# EAGLE design Breakout_v2 (EAGLE 7.5.0)
CNAME: EARS PocketQube Breakout Board; CREVISION: 2.0; DESIGNER: L. Stant
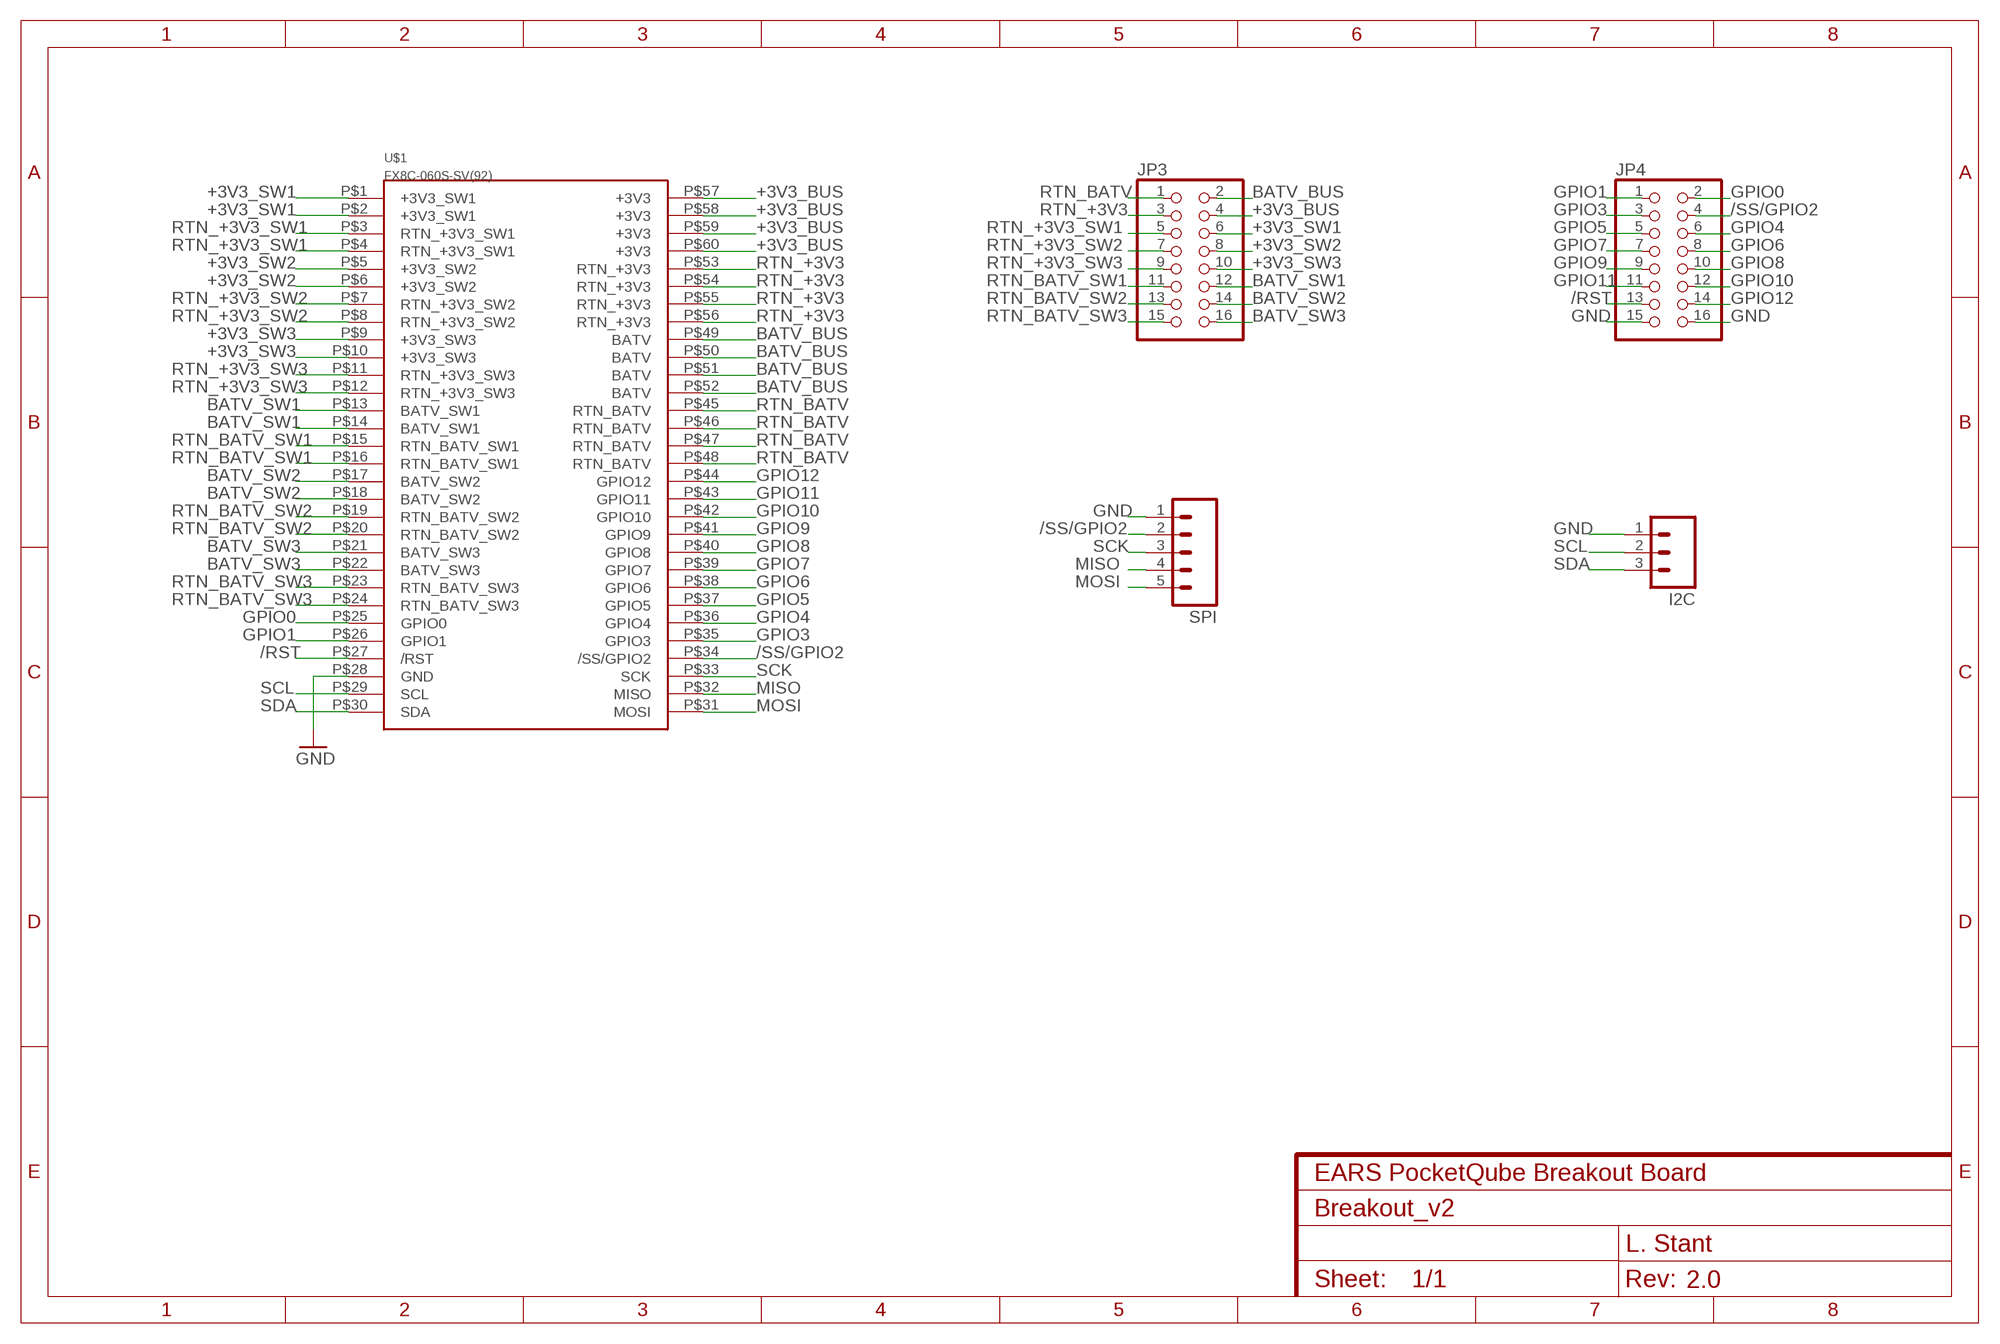
[diagram p0: schematic, sheet 1]

## Parts
I2C  M03PTH  [1X03]
JP3  PINHD-2X8  [2X08]
JP4  PINHD-2X8  [2X08]
SPI  M05PTH  [1X05]
U$1  FX8C-060S-SV(92)  [FX8C-060S-SV(92)]

## Nets
+3V3_BUS: JP3.4 U$1.P$57(+3V3) U$1.P$58(+3V3) U$1.P$59(+3V3) U$1.P$60(+3V3)
+3V3_SW1: JP3.6 U$1.P$1(+3V3_SW1) U$1.P$2(+3V3_SW1)
+3V3_SW2: JP3.8 U$1.P$5(+3V3_SW2) U$1.P$6(+3V3_SW2)
+3V3_SW3: JP3.10 U$1.P$9(+3V3_SW3) U$1.P$10(+3V3_SW3)
/RST: JP4.13 U$1.P$27(/RST)
/SS/GPIO2: JP4.4 SPI.2 U$1.P$34(/SS/GPIO2)
BATV_BUS: JP3.2 U$1.P$49(BATV) U$1.P$50(BATV) U$1.P$51(BATV) U$1.P$52(BATV)
BATV_SW1: JP3.12 U$1.P$13(BATV_SW1) U$1.P$14(BATV_SW1)
BATV_SW2: JP3.14 U$1.P$17(BATV_SW2) U$1.P$18(BATV_SW2)
BATV_SW3: JP3.16 U$1.P$21(BATV_SW3) U$1.P$22(BATV_SW3)
GND: I2C.1 JP4.15 JP4.16 SPI.1 U$1.P$28(GND)
GPIO0: JP4.2 U$1.P$25(GPIO0)
GPIO1: JP4.1 U$1.P$26(GPIO1)
GPIO3: JP4.3 U$1.P$35(GPIO3)
GPIO4: JP4.6 U$1.P$36(GPIO4)
GPIO5: JP4.5 U$1.P$37(GPIO5)
GPIO6: JP4.8 U$1.P$38(GPIO6)
GPIO7: JP4.7 U$1.P$39(GPIO7)
GPIO8: JP4.10 U$1.P$40(GPIO8)
GPIO9: JP4.9 U$1.P$41(GPIO9)
GPIO10: JP4.12 U$1.P$42(GPIO10)
GPIO11: JP4.11 U$1.P$43(GPIO11)
GPIO12: JP4.14 U$1.P$44(GPIO12)
MISO: SPI.4 U$1.P$32(MISO)
MOSI: SPI.5 U$1.P$31(MOSI)
RTN_+3V3: JP3.3 U$1.P$53(RTN_+3V3) U$1.P$54(RTN_+3V3) U$1.P$55(RTN_+3V3) U$1.P$56(RTN_+3V3)
RTN_+3V3_SW1: JP3.5 U$1.P$3(RTN_+3V3_SW1) U$1.P$4(RTN_+3V3_SW1)
RTN_+3V3_SW2: JP3.7 U$1.P$7(RTN_+3V3_SW2) U$1.P$8(RTN_+3V3_SW2)
RTN_+3V3_SW3: JP3.9 U$1.P$11(RTN_+3V3_SW3) U$1.P$12(RTN_+3V3_SW3)
RTN_BATV: JP3.1 U$1.P$45(RTN_BATV) U$1.P$46(RTN_BATV) U$1.P$47(RTN_BATV) U$1.P$48(RTN_BATV)
RTN_BATV_SW1: JP3.11 U$1.P$15(RTN_BATV_SW1) U$1.P$16(RTN_BATV_SW1)
RTN_BATV_SW2: JP3.13 U$1.P$19(RTN_BATV_SW2) U$1.P$20(RTN_BATV_SW2)
RTN_BATV_SW3: JP3.15 U$1.P$23(RTN_BATV_SW3) U$1.P$24(RTN_BATV_SW3)
SCK: SPI.3 U$1.P$33(SCK)
SCL: I2C.2 U$1.P$29(SCL)
SDA: I2C.3 U$1.P$30(SDA)

## Library data of the parts
I2C = SparkFun-Connectors:M03: Header 3 Standard 3-pin 0.1" header. Use with straight break away headers (SKU : PRT-00116), right angle break away headers (PRT-00553), swiss pins (PRT-00743), machine pins (PRT-00117), and female headers (PRT-00115). Molex polarized connector foot print use with SKU : PRT-08232 with associated crimp pins and housings.
JP3 JP4 = pinhead:PINHD-2X8: PIN HEADER
SPI = SparkFun-Connectors:M05: Header 5 Standard 5-pin 0.1" header. Use with straight break away headers (SKU : PRT-00116), right angle break away headers (PRT-00553), swiss pins (PRT-00743), machine pins (PRT-00117), and female headers (PRT-00115). Molex polarized connector foot print use with SKU : PRT-08230 with associated crimp pins and housings.
U$1 = Template:FX8C-060S-SV(92)

## Board
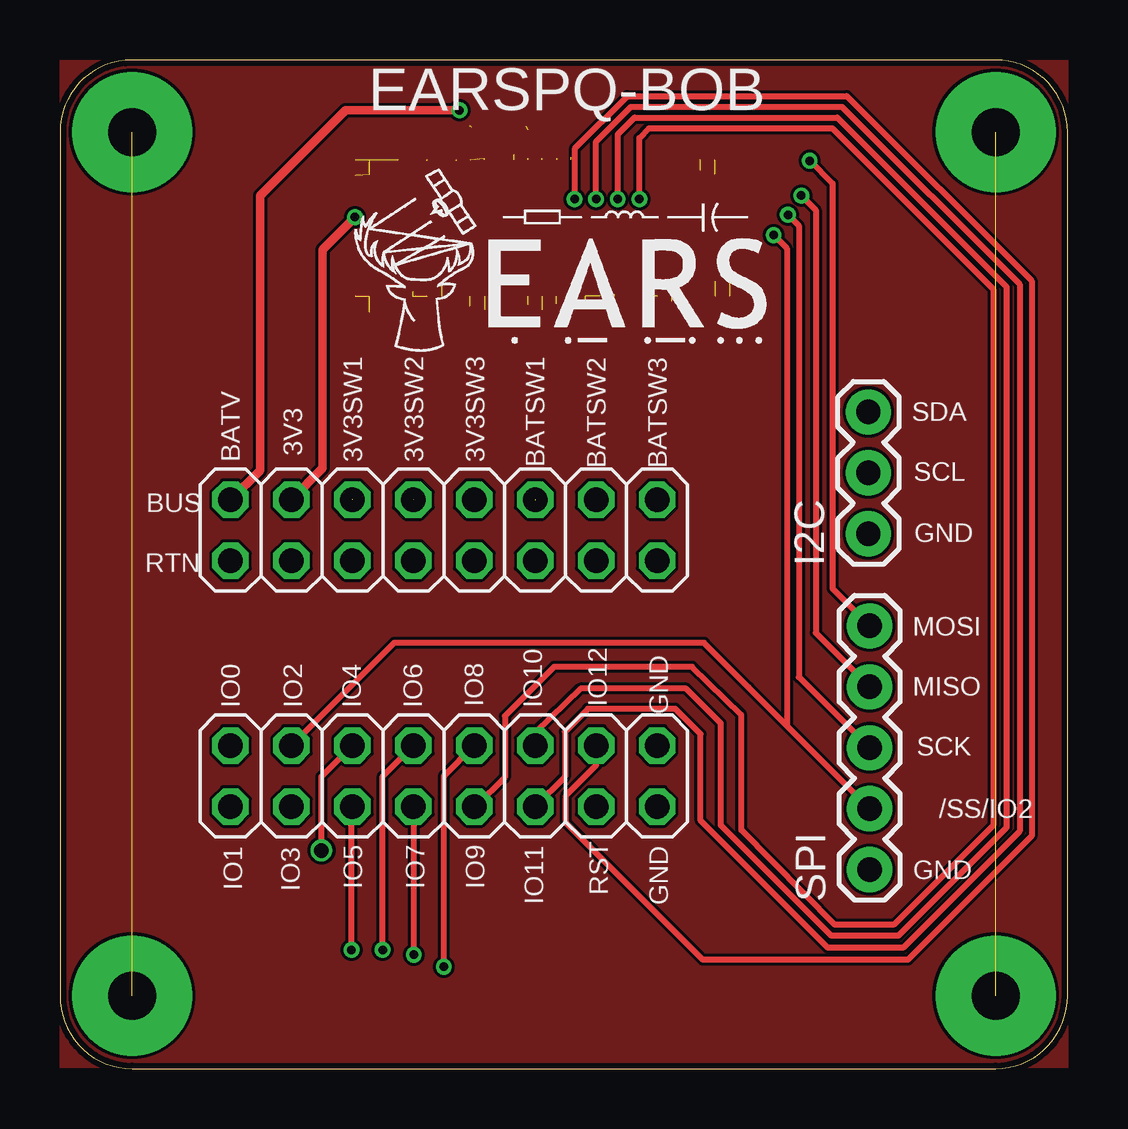
[diagram p1: board, top side]
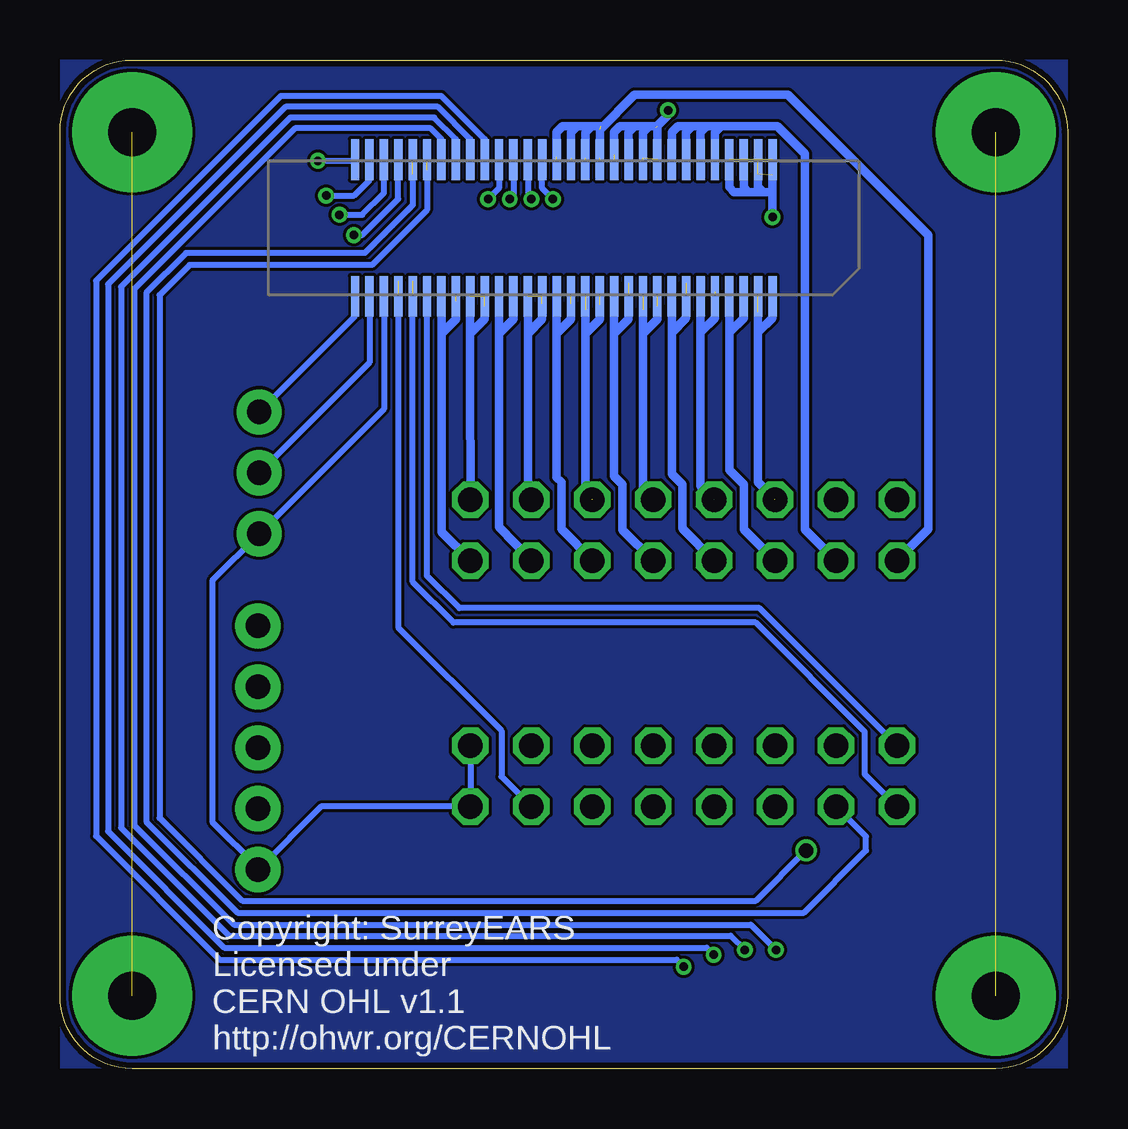
[diagram p2: board, bottom side, seen from below]

Size 42 x 42.05 mm. Coordinates in mm from the lower left corner, seen from the top.
Outline: 3,0 39,0 arc90 42,3.05 42,39.05 arc90 39,42.05 3,42.05 arc90 0,39.05 0,3.05 arc90 3,0
Copper layers (1*16): Top 0.035mm / dielectric 1.5mm / Bottom 0.035mm
Design rules "dirt_cheap_dirty_boards.v1": minimum track width 5mil, minimum drill 12mil, track to track 5mil, track to pad 5mil, pad to pad 5mil, via to via 5mil, smd to smd 0mil, copper to edge 10mil, drill to drill 10mil, minimum pad ring 10mil, minimum via ring 6mil, stop-mask expansion 2mil, vias tented up to drill 25mil, thermal gap 10mil

### Footprints (pad centres in the part's own frame; a part is rotated, then mirrored left to right if it is on the bottom)
1X03 = drill 1.016 pad 1.88: 1 0,0; 2 2.54,0; 3 5.08,0
2X08 = drill 1.016 octagon: 1 -8.89,-1.27; 2 -8.89,1.27; 3 -6.35,-1.27; 4 -6.35,1.27; 5 -3.81,-1.27; 6 -3.81,1.27; 7 -1.27,-1.27; 8 -1.27,1.27; 9 1.27,-1.27; 10 1.27,1.27; 11 3.81,-1.27; 12 3.81,1.27; 13 6.35,-1.27; 14 6.35,1.27; 15 8.89,-1.27; 16 8.89,1.27
1X05 = drill 1.016 pad 1.88: 1 0,0; 2 2.54,0; 3 5.08,0; 4 7.62,0; 5 10.16,0
FX8C-060S-SV(92) = smd 0.35 x 1.7: P$1 -8.7,2.85; P$2 -8.1,2.85; P$3 -7.5,2.85; P$4 -6.9,2.85; P$5 -6.3,2.85; P$6 -5.7,2.85; P$7 -5.1,2.85; P$8 -4.5,2.85; P$9 -3.9,2.85; P$10 -3.3,2.85; P$11 -2.7,2.85; P$12 -2.1,2.85; P$13 -1.5,2.85; P$14 -0.9,2.85; P$15 -0.3,2.85; P$16 0.3,2.85; P$17 0.9,2.85; P$18 1.5,2.85; P$19 2.1,2.85; P$20 2.7,2.85; P$21 3.3,2.85; P$22 3.9,2.85; P$23 4.5,2.85; P$24 5.1,2.85; P$25 5.7,2.85; P$26 6.3,2.85; P$27 6.9,2.85; P$28 7.5,2.85; P$29 8.1,2.85; P$30 8.7,2.85; P$31 8.7,-2.85; P$32 8.1,-2.85; P$33 7.5,-2.85; P$34 6.9,-2.85; P$35 6.3,-2.85; P$36 5.7,-2.85; P$37 5.1,-2.85; P$38 4.5,-2.85; P$39 3.9,-2.85; P$40 3.3,-2.85; P$41 2.7,-2.85; P$42 2.1,-2.85; P$43 1.5,-2.85; P$44 0.9,-2.85; P$45 0.3,-2.85; P$46 -0.3,-2.85; P$47 -0.9,-2.85; P$48 -1.5,-2.85; P$49 -2.1,-2.85; P$50 -2.7,-2.85; P$51 -3.3,-2.85; P$52 -3.9,-2.85; P$53 -4.5,-2.85; P$54 -5.1,-2.85; P$55 -5.7,-2.85; P$56 -6.3,-2.85; P$57 -6.9,-2.85; P$58 -7.5,-2.85; P$59 -8.1,-2.85; P$60 -8.7,-2.85

### Placement (x,y rotation side)
I2C  33.7,22.3 90 top
JP3  16,22.45 0 top
JP4  16,12.2 0 top
SPI  33.75,8.3 90 top
U$1  21,35.05 180 bottom
U$2  [EARSLOGOFULL]  21.7,32.75 0 top

### Tracks (layer width: path | path; a pad name or v marks a point on that pad's centre or on a via)
+3V3_BUS  (via drill 0.36)  (5 unrouted)
  Top 0.36: JP3.4 10.95,25.05 10.95,34.15 v12.3,35.5
  Bottom 0.36: 12.3,37.25 v12.3,35.5 | 14.1,37.15 14.1,36.75 13.9,36.55 13.3,36.55 | 13.3,36.55 12.7,36.55 | 12.7,36.55 12.3,36.55 | 13.5,37.25 13.5,36.75 13.3,36.55 | 12.9,37.3 12.9,36.75 12.7,36.55
+3V3_SW1  (3 unrouted)
  Bottom 0.36: 12.19,23.74 12.9,24.45 12.9,30.7 | 12.3,31.3 12.9,30.7 | 12.9,31.55 12.9,30.7
+3V3_SW2  (3 unrouted)
  Bottom 0.36: JP3.8 15.3,24.3 15.3,30.7 | 14.7,32.4 14.7,31.3 15.3,30.7 | 15.3,31.55 15.3,30.7
+3V3_SW3  (2 unrouted)
  Bottom 0.36: JP3.10 17.7,24.15 17.7,30.4 17.7,30.65 | 17.1,31.8 17.1,31.25 17.7,30.65 | 17.7,31.65 17.7,30.65
/RST  (1 unrouted)
  Bottom 0.254: 27.9,32.82 27.9,18.4 23.6,14.1 23.6,12.18 JP4.13
/SS/GPIO2  (via drill 0.36)
  Top 0.254: 30.3,14.29 30.3,34.2 v29.75,34.75 | 30.3,14.29 SPI.2 | 30.3,14.29 28.7,15.89 28.7,15.9 26.85,17.75 13.93,17.75 JP4.4
  Bottom 0.254: v29.75,34.75 29.4,34.75 27.9,36.25 U$1.P$34
BATV_BUS  (via drill 0.36)  (4 unrouted)
  Top 0.36: JP3.2 8.35,24.93 8.35,36.4 11.9,39.95 v16.65,39.95
  Bottom 0.36: v16.65,39.95 16.65,39.75 17.15,39.25 | 17.45,39.3 17.1,39.3 17.1,38.6 | 17.45,39.3 17.7,39.05 17.7,37.95 | 17.45,39.3 18.05,39.3 | 18.05,39.3 18.3,39.05 U$1.P$50 | 18.05,39.3 18.65,39.3 18.9,39.05 18.9,38.1
BATV_SW1  (3 unrouted)
  Bottom 0.36: JP3.12 20.1,24 20.1,30.65 | 19.5,31.85 19.5,31.25 20.1,30.65 | 20.1,31.65 20.1,30.65
BATV_SW2  (2 unrouted)
  Bottom 0.36: 22.5,23.85 22.5,30.65 | 21.9,31.9 21.9,31.25 22.5,30.65 | 22.5,31.6 22.5,30.65
  Bottom 0.406: 22.5,23.85 22.48,23.85 JP3.14
BATV_SW3  (2 unrouted)
  Bottom 0.36: JP3.16 24.9,28.71 24.9,30.55 24.9,30.65 | 24.3,31.8 24.3,31.25 24.9,30.65 | 24.9,31.55 24.9,30.65
BOARD
  pour Bottom: 0,42.05 42,42.05 42,0.05 0,0.05
  pour Top: 0,42.05 42,42.05 42,0.05 0,0.05
CHASSIS_GND  (via drill 2 pad 5)  (1 unrouted)
  other vias: 39,39.05 39,3.05
GND
  Bottom 0.254: 24.9,10.95 24.89,10.96 JP4.16 JP4.15 31.12,10.93 SPI.1 33.75,8.4 35.65,10.3 35.65,20.35 I2C.1 28.5,27.5 U$1.P$28
GPIO0
  Bottom 0.254: JP4.2 12.84,19.2 25.35,19.2 26.7,20.55 U$1.P$25
GPIO1  (1 unrouted)
  Bottom 0.254: JP4.1 8.45,12.27 8.45,14.05 13,18.6 25.6,18.6 27.3,20.3 27.3,32.82 27.35,32.88
GPIO3  (1 unrouted)
  Bottom 0.254: 27.3,37.3 27.3,36 29.3,34 36.75,34 38.4,32.35 38.4,10.3 34.6,6.5 11,6.5 8.4,9.1 8.4,9.68 JP4.3
GPIO4  (via drill 0.6)  (1 unrouted)
  Top 0.254: v10.9,9.1 10.9,12.18 JP4.6
  Bottom 0.254: 26.7,37.45 26.7,35.8 29,33.5 36.6,33.5 37.85,32.25 37.85,10.45 34.4,7 13,7 v10.9,9.1
GPIO5  (via drill 0.36 pad 0.36)
  Top 0.254: v12.15,4.95 12.15,10.92 JP4.5
  Bottom 0.254: U$1.P$37 26.1,38.75 26.55,39.2 32.2,39.2 38.9,32.5 38.9,10.15 34.75,6 13.2,6 v12.15,4.95
GPIO6  (via drill 0.36 pad 0.36)
  Top 0.254: v13.45,4.95 13.45,12.19 JP4.8
  Bottom 0.254: U$1.P$38 25.5,38.75 26.4,39.65 32.4,39.65 39.45,32.6 39.45,10.05 34.95,5.55 14.05,5.55 v13.45,4.95
GPIO7  (via drill 0.36 pad 0.36)
  Top 0.254: v14.75,4.75 14.75,10.91 JP4.7
  Bottom 0.254: U$1.P$39 24.9,38.75 26.25,40.1 32.6,40.1 40,32.7 40,9.9 35.15,5.05 15.05,5.05 v14.75,4.75
GPIO8  (via drill 0.36 pad 0.36)
  Top 0.254: v16,4.25 16,12.2 JP4.10
  Bottom 0.254: U$1.P$40 24.3,38.75 26.1,40.55 32.8,40.55 40.5,32.85 40.5,9.7 35.35,4.55 16.3,4.55 v16,4.25
GPIO9  (via drill 0.36)
  Top 0.254: JP4.9 17.33,10.93 18.55,12.15 18.55,14.7 20.6,16.75 26.35,16.75 28.4,14.75 28.4,9.95 32.3,6 34.75,6 38.9,10.15 38.9,32.5 32.2,39.2 24.55,39.2 24.15,38.8 v24.15,36.25
  Bottom 0.254: U$1.P$41 23.7,36.7 v24.15,36.25
GPIO10  (via drill 0.36)
  Top 0.254: JP4.12 19.81,14.01 21.7,15.85 26.1,15.85 27.55,14.4 27.55,10.15 32.15,5.55 34.95,5.55 39.45,10.05 39.45,32.6 32.4,39.65 23.95,39.65 23.25,38.95 v23.25,36.25
  Bottom 0.254: U$1.P$42 23.1,36.4 v23.25,36.25
GPIO11  (via drill 0.36)
  Top 0.254: JP4.11 21.05,12.17 21.05,14.05 22,15 25.65,15 26.7,13.95 26.7,10.35 32,5.05 35.15,5.05 40,9.9 40,32.7 32.6,40.1 23.8,40.1 22.35,38.65 v22.35,36.25
  Bottom 0.254: U$1.P$43 22.5,36.4 v22.35,36.25
GPIO12  (via drill 0.36)
  Top 0.254: JP4.14 22.35,12.65 21.1,11.4 21.1,10.25 26.8,4.55 35.35,4.55 40.5,9.7 40.5,32.85 32.8,40.55 23.65,40.55 21.45,38.35 v21.45,36.25
  Bottom 0.254: v21.45,36.25 21.9,36.7 U$1.P$44
MISO  (via drill 0.36)
  Top 0.254: SPI.4 31.5,18.17 31.5,35.8 v30.9,36.4
  Bottom 0.254: v30.9,36.4 29.75,36.4 29.1,37.05 U$1.P$32
MOSI  (via drill 0.36)
  Top 0.254: SPI.5 32.2,20.01 32.2,36.9 v31.25,37.85
  Bottom 0.254: v31.25,37.85 29.75,37.85 U$1.P$31
N$24  (via drill 2 pad 5)  (1 unrouted)
  other vias: 3,39.05 3,3.05
RTN_+3V3  (2 unrouted)
  Bottom 0.36: U$1.P$56 14.7,39.05 14.45,39.3 | 14.45,39.3 12.1,39.3 10.95,38.15 10.95,22.48 JP3.3 | 14.45,39.3 15.05,39.3 | 15.05,39.3 15.3,39.05 15.3,37.85 | 15.05,39.3 15.65,39.3 | 15.65,39.3 15.9,39.05 U$1.P$54 | 15.65,39.3 16.25,39.3 16.5,39.05 16.5,37.85
RTN_+3V3_SW1
  Bottom 0.36: U$1.P$4 14.1,30.7 | 14.1,30.7 14.1,24.95 13.5,24.35 13.5,22.47 JP3.5 | U$1.P$3 13.5,31.3 14.1,30.7
RTN_+3V3_SW2  (1 unrouted)
  Bottom 0.36: U$1.P$8 16.5,30.68 | 16.5,30.68 16.5,24.8 16.05,24.35 16.05,22.51 JP3.7 | 15.9,32.75 15.9,31.28 16.5,30.68
RTN_+3V3_SW3  (1 unrouted)
  Bottom 0.36: U$1.P$12 18.9,30.65 | 18.9,30.65 18.9,24.7 18.55,24.35 18.55,22.45 JP3.9 | 18.3,32.75 18.3,31.25 18.9,30.65
RTN_BATV  (5 unrouted)
  Bottom 0.35: 20.1,37.95 20.1,37.8
  Bottom 0.36: 19.5,37.95 19.5,39.15 18.05,40.6 11.65,40.6 5.8,34.75 5.8,22.49 JP3.1 | 19.45,39.3 19.85,39.3 | 19.85,39.3 20.1,39.05 20.1,37.8 | 19.85,39.3 20.45,39.3 | 20.45,39.3 20.7,39.05 20.7,37.95 | 20.45,39.3 21.05,39.3 21.3,39.05 21.3,38
RTN_BATV_SW1  (1 unrouted)
  Bottom 0.36: JP3.11 21.1,22.49 21.1,24.45 21.3,24.65 21.3,30.65 | 21.3,30.65 U$1.P$16 | 20.7,31.9 20.7,31.25 21.3,30.65
RTN_BATV_SW2  (1 unrouted)
  Bottom 0.36: JP3.13 23.7,22.58 23.7,30.65 | 23.7,30.65 U$1.P$20 | 23.1,32.3 23.1,31.25 23.7,30.65
RTN_BATV_SW3  (1 unrouted)
  Bottom 0.36: JP3.15 26.1,22.37 26.1,30.65 | 26.1,30.65 U$1.P$24 | 25.5,32 25.5,31.25 26.1,30.65
SCK  (via drill 0.36)
  Top 0.254: SPI.3 30.8,16.33 30.8,35.15 v30.35,35.6
  Bottom 0.254: v30.35,35.6 29.4,35.6 28.5,36.5 U$1.P$33
SCL
  Bottom 0.254: U$1.P$29 29.1,29.44 I2C.2
SDA
  Bottom 0.254: U$1.P$30 29.7,31.38 I2C.3

### Text on the board
tNames: EARSPQ-BOB | 3V3SW1 | 3V3SW2 | 3V3SW3 | BATSW1 | BATSW2 | BATSW3 | BATV | 3V3 | SDA | SCL | BUS | GND | RTN | MOSI | GND | MISO | IO0 | IO2 | IO4 | IO6 | IO8 | IO10 | IO12 | SCK | /SS/IO2 | GND | GND | IO1 | IO3 | IO5 | IO7 | IO9 | IO11 | RST
bNames: Copyright: SurreyEARS / Licensed under / CERN OHL v1.1 / http://ohwr.org/CERNOHL